# EAGLE design bcard (EAGLE 5.02)
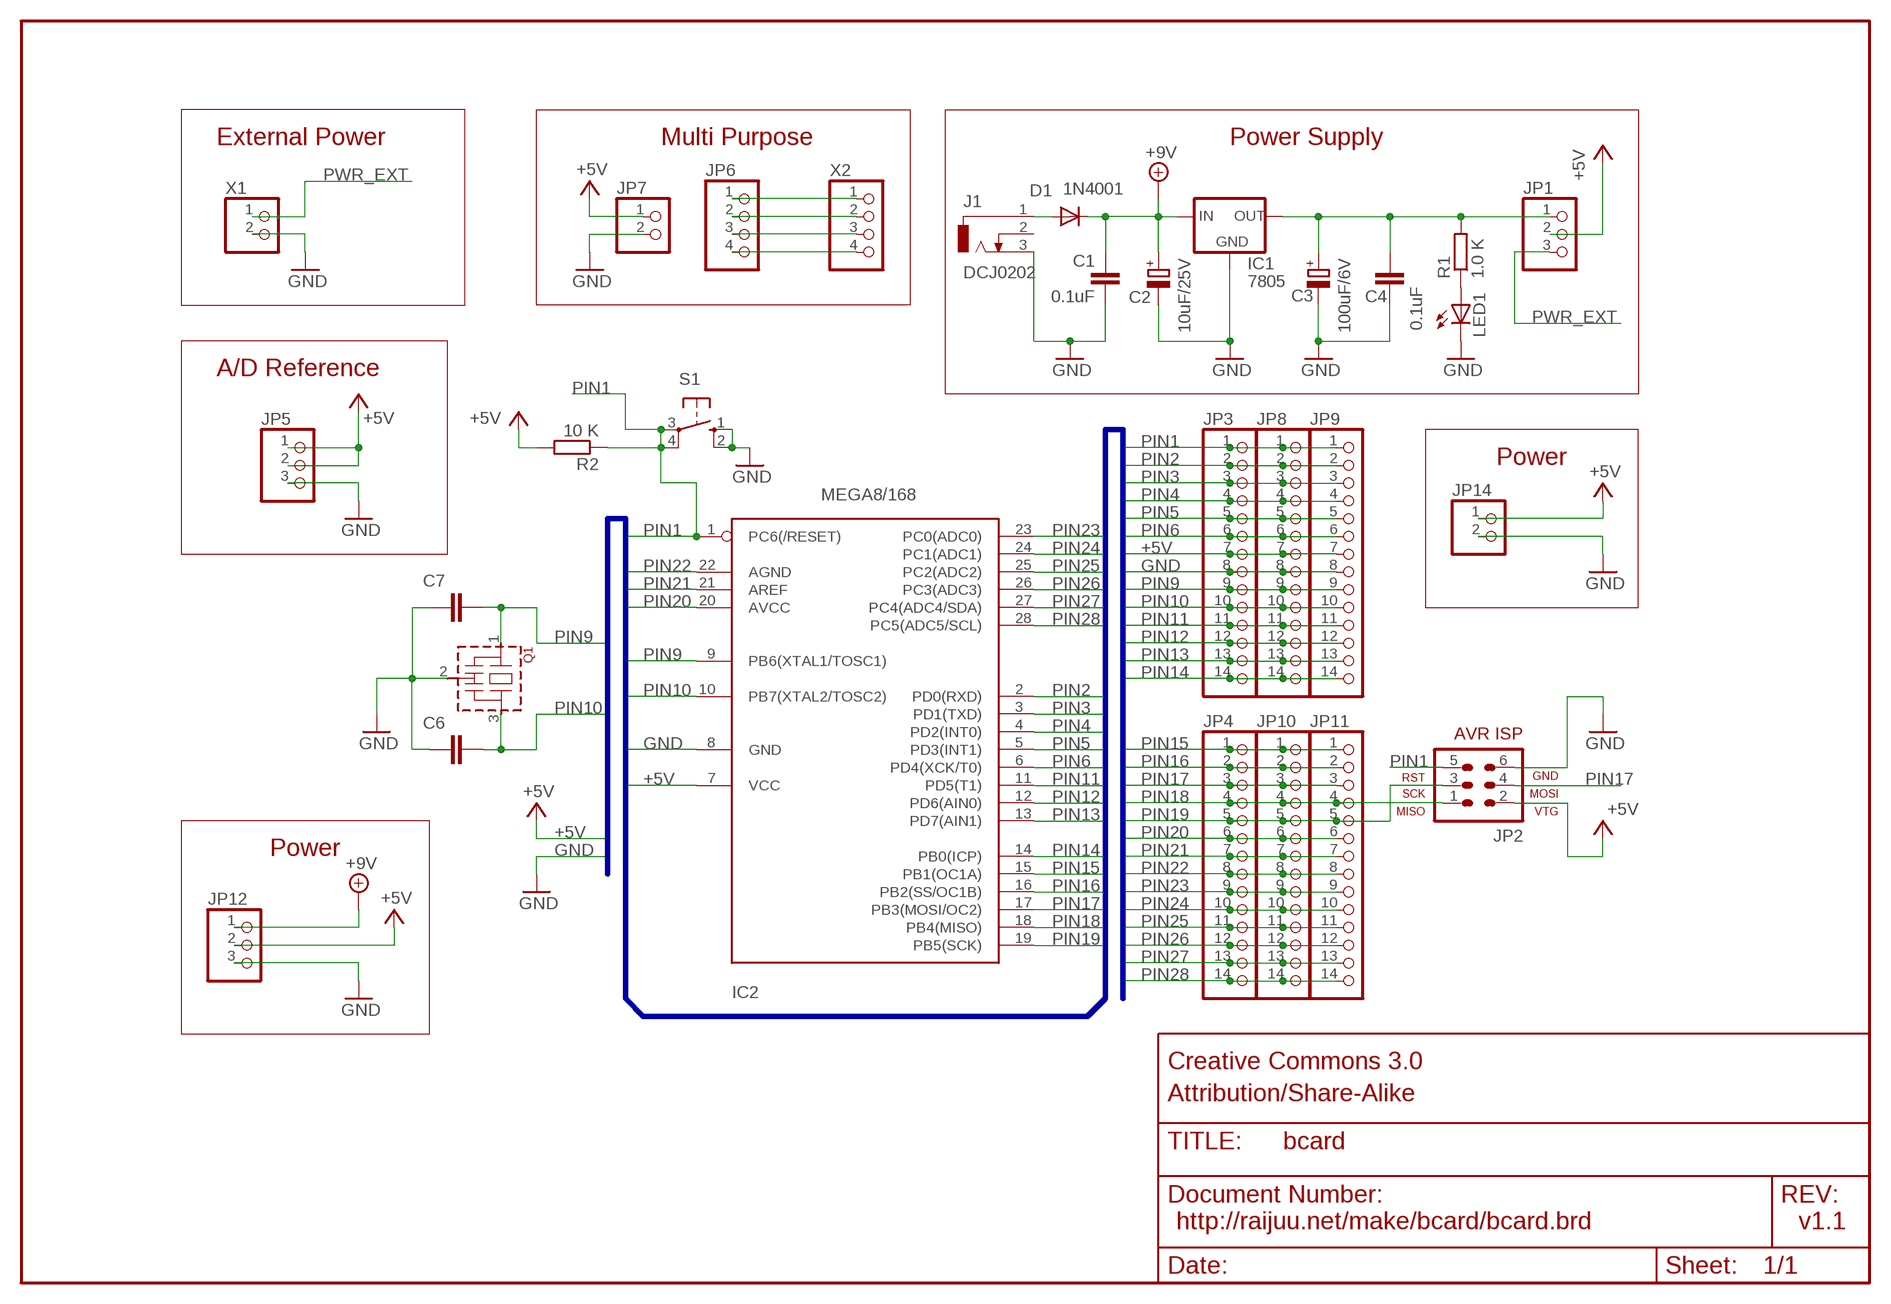
[diagram p0: schematic, sheet 1]

## Parts
C1  0.1uF  C-EU025-025X050  [C025-025X050]
C2  10uF/25V  CPOL-EUE2.5-6  [E2,5-6]
C3  100uF/6V  CPOL-EUE2.5-6  [E2,5-6]
C4  0.1uF  C-EU025-025X050  [C025-025X050]
C6  C-EU025-025X050  [C025-025X050]
C7  C-EU025-025X050  [C025-025X050]
D1  1N4001  1N4004  [DO41-10]
IC1  7805  78XXS  [78XXS]
IC2  MEGA8/168  MEGA8-P  [DIL28-3]
J1  DCJ0202  [DCJ0202A]
JP1  PINHD-1X3  [1X03]
JP2  AVR-ISP-6  AVR-ISP-6-C  [AVR-ISP-6]
JP3  PINHD-1X14  [1X14]
JP4  PINHD-1X14  [1X14]
JP5  PINHD-1X3  [1X03]
JP6  PINHD-1X4  [1X04]
JP7  PINHD-1X2  [1X02]
JP8  PINHD-1X14  [1X14]
JP9  PINHD-1X14  [1X14]
JP10  PINHD-1X14  [1X14]
JP11  PINHD-1X14  [1X14]
JP12  PINHD-1X3  [1X03]
JP14  PINHD-1X2  [1X02]
LED1  LED5MM  [LED5MM]
Q1  CSTLS_G*  [CSTLS_G9]
R1  1.0 K  R-EU_0207/10  [0207/10]
R2  10 K  R-EU_0207/10  [0207/10]
S1  10-XX  [B3F-10XX]
X1  W237-102  [W237-102]
X2  22-23-2041  [22-23-2041]

## Nets
+5V: IC2.7(VCC) JP1.2 JP2.2(VTG) JP3.7 JP5.1 JP5.2 JP7.1 JP8.7 JP9.7 JP12.2 JP14.1 R2.2
+9V: C1.1 C2.+ D1.C IC1.IN JP12.1
GND: C1.2 C2.- C3.- C4.2 C6.1 C7.1 IC1.GND IC2.8(GND) J1.3 JP2.6(GND) JP3.8 JP5.3 JP7.2 JP8.8 JP9.8 JP12.3 JP14.2 LED1.K(C) Q1.2(VSS) S1.1(S) S1.2(S1) X1.2
N$2: LED1.A R1.1
N$3: C3.+ C4.1 IC1.OUT JP1.1 R1.2
N$5: JP6.1 X2.1
N$6: JP6.2 X2.2
N$7: JP6.3 X2.3
N$8: JP6.4 X2.4
N$17: D1.A J1.1
PIN1: IC2.1(PC6(/RESET)) JP2.5(RST) JP3.1 JP8.1 JP9.1 R2.1 S1.3(P) S1.4(P1)
PIN2: IC2.2(PD0(RXD)) JP3.2 JP8.2 JP9.2
PIN3: IC2.3(PD1(TXD)) JP3.3 JP8.3 JP9.3
PIN4: IC2.4(PD2(INT0)) JP3.4 JP8.4 JP9.4
PIN5: IC2.5(PD3(INT1)) JP3.5 JP8.5 JP9.5
PIN6: IC2.6(PD4(XCK/T0)) JP3.6 JP8.6 JP9.6
PIN9: C7.2 IC2.9(PB6(XTAL1/TOSC1)) JP3.9 JP8.9 JP9.9 Q1.1
PIN10: C6.2 IC2.10(PB7(XTAL2/TOSC2)) JP3.10 JP8.10 JP9.10 Q1.3
PIN11: IC2.11(PD5(T1)) JP3.11 JP8.11 JP9.11
PIN12: IC2.12(PD6(AIN0)) JP3.12 JP8.12 JP9.12
PIN13: IC2.13(PD7(AIN1)) JP3.13 JP8.13 JP9.13
PIN14: IC2.14(PB0(ICP)) JP3.14 JP8.14 JP9.14
PIN15: IC2.15(PB1(OC1A)) JP4.1 JP10.1 JP11.1
PIN16: IC2.16(PB2(SS/OC1B)) JP4.2 JP10.2 JP11.2
PIN17: IC2.17(PB3(MOSI/OC2)) JP2.4(MOSI) JP4.3 JP10.3 JP11.3
PIN18: IC2.18(PB4(MISO)) JP2.1(MISO) JP4.4 JP10.4 JP11.4
PIN19: IC2.19(PB5(SCK)) JP2.3(SCK) JP4.5 JP10.5 JP11.5
PIN20: IC2.20(AVCC) JP4.6 JP10.6 JP11.6
PIN21: IC2.21(AREF) JP4.7 JP10.7 JP11.7
PIN22: IC2.22(AGND) JP4.8 JP10.8 JP11.8
PIN23: IC2.23(PC0(ADC0)) JP4.9 JP10.9 JP11.9
PIN24: IC2.24(PC1(ADC1)) JP4.10 JP10.10 JP11.10
PIN25: IC2.25(PC2(ADC2)) JP4.11 JP10.11 JP11.11
PIN26: IC2.26(PC3(ADC3)) JP4.12 JP10.12 JP11.12
PIN27: IC2.27(PC4(ADC4/SDA)) JP4.13 JP10.13 JP11.13
PIN28: IC2.28(PC5(ADC5/SCL)) JP4.14 JP10.14 JP11.14
PWR_EXT: JP1.3 X1.1
Unconnected: J1.2

## Buses
B$1

## Notes on the sheet
- External Power | Multi Purpose | Power Supply
- A/D Reference
- Power
- Power
- Creative Commons 3.0
- Attribution/Share-Alike
- http://raijuu.net/make/bcard/bcard.brd | v1.1

## Library data of the parts
C1 C4 C6 C7 = mega:C-EU: CAPACITOR, European symbol
C2 C3 = mega:CPOL-EU: POLARIZED CAPACITOR, European symbol
D1 = mega:1N4004: DIODE general purpose rectifier, 1 A
IC1 = mega:78XXS: VOLTAGE REGULATOR
IC2 = mega:MEGA8-P: MICROCONTROLLER 8 Kbytes FLASH 1 kbytes SRAM 512 bytes EEPROM USART 4-channel 10 bit ADC 2-channel 8 bit ADC Source: avr.lbr
J1 = mega:DCJ0202: DC POWER JACK Source: DCJ0202.pdf
JP1 JP5 JP12 = mega:PINHD-1X3: PIN HEADER
JP2 = mega:AVR-ISP-6-C: AVR ISP-6 Serial Programming Header
JP3 JP4 JP8-JP11 = mega:PINHD-1X14: PIN HEADER
JP6 = mega:PINHD-1X4: PIN HEADER
JP7 JP14 = mega:PINHD-1X2: PIN HEADER
LED1 = mega:LED: LED OSRAM: - CHIPLED LG R971, LG N971, LY N971, LG Q971, LY Q971, LO R971, LY R971 LH N974, LH R974 LS Q976, LO Q976, LY Q976 LO Q996 - Hyper CHIPLED LW Q18S LB Q993, LB Q99A, LB R99A - SideLED LS A670, LO A670, LY A670, LG A670, LP A670 LB A673, LV A673, LT A673, LW A673 LH A674 LY A675 LS A676, LA A676, LO A676, LY A676, LW A676 LS A679, LY A679, LG A679 - Hyper Micro SIDELED® LS Y876, LA Y876, LO Y876, LY Y876 LT Y87S - SmartLED LW L88C, LW L88S LB L89C, LB L89S, LG L890 LS L89K, LO L89K, LY L89K LS L896, LA L896, LO L896, LY L896 - TOPLED LS T670, LO T670, LY T670, LG T670, LP T670 LSG T670, LSP T670, LSY T670, LOP T670, LYG T670 LG T671, LOG T671, LSG T671 LB T673, LV T673, LT T673, LW T673 LH T674 LS T676, LA T676, LO T676, LY T676, LB T676, LH T676, LSB T676, LW T676 LB T67C, LV T67C, LT T67C, LS T67K, LO T67K, LY T67K, LW E67C LS E67B, LA E67B, LO E67B, LY E67B, LB E67C, LV E67C, LT E67C LW T67C LS T679, LY T679, LG T679 LS T770, LO T770, LY T770, LG T770, LP T770 LB T773, LV T773, LT T773, LW T773 LH T774 LS E675, LA E675, LY E675, LS T675 LS T776, LA T776, LO T776, LY T776, LB T776 LHGB T686 LT T68C, LB T68C - Hyper Mini TOPLED® LB M676 - Mini TOPLED Santana® LG M470 LS M47K, LO M47K, LY M47K Source: http://www.osram.convergy.de - LUMILED® LXK2-PW12-R00, LXK2-PW12-S00, LXK2-PW14-U00, LXK2-PW14-V00 LXK2-PM12-R00, LXK2-PM12-S00, LXK2-PM14-U00 LXK2-PE12-Q00, LXK2-PE12-R00, LXK2-PE12-S00, LXK2-PE14-T00, LXK2-PE14-U00 LXK2-PB12-K00, LXK2-PB12-L00, LXK2-PB12-M00, LXK2-PB14-N00, LXK2-PB14-P00, LXK2-PB14-Q00 LXK2-PR12-L00, LXK2-PR12-M00, LXK2-PR14-Q00, LXK2-PR14-R00 LXK2-PD12-Q00, LXK2-PD12-R00, LXK2-PD12-S00 LXK2-PH12-R00, LXK2-PH12-S00 LXK2-PL12-P00, LXK2-PL12-Q00, LXK2-PL12-R00 Source: www.luxeon.com
Q1 = mega:CSTLS_G: Ceramic resonator 2.00 to 10.00 MHz
R1 R2 = mega:R-EU_: RESISTOR, European symbol
S1 = mega:10-XX: OMRON SWITCH
X1 = mega:W237-102: WAGO SCREW CLAMP
X2 = mega:22-23-2041: .100" (2.54mm) Center Header - 4 Pin

## Board
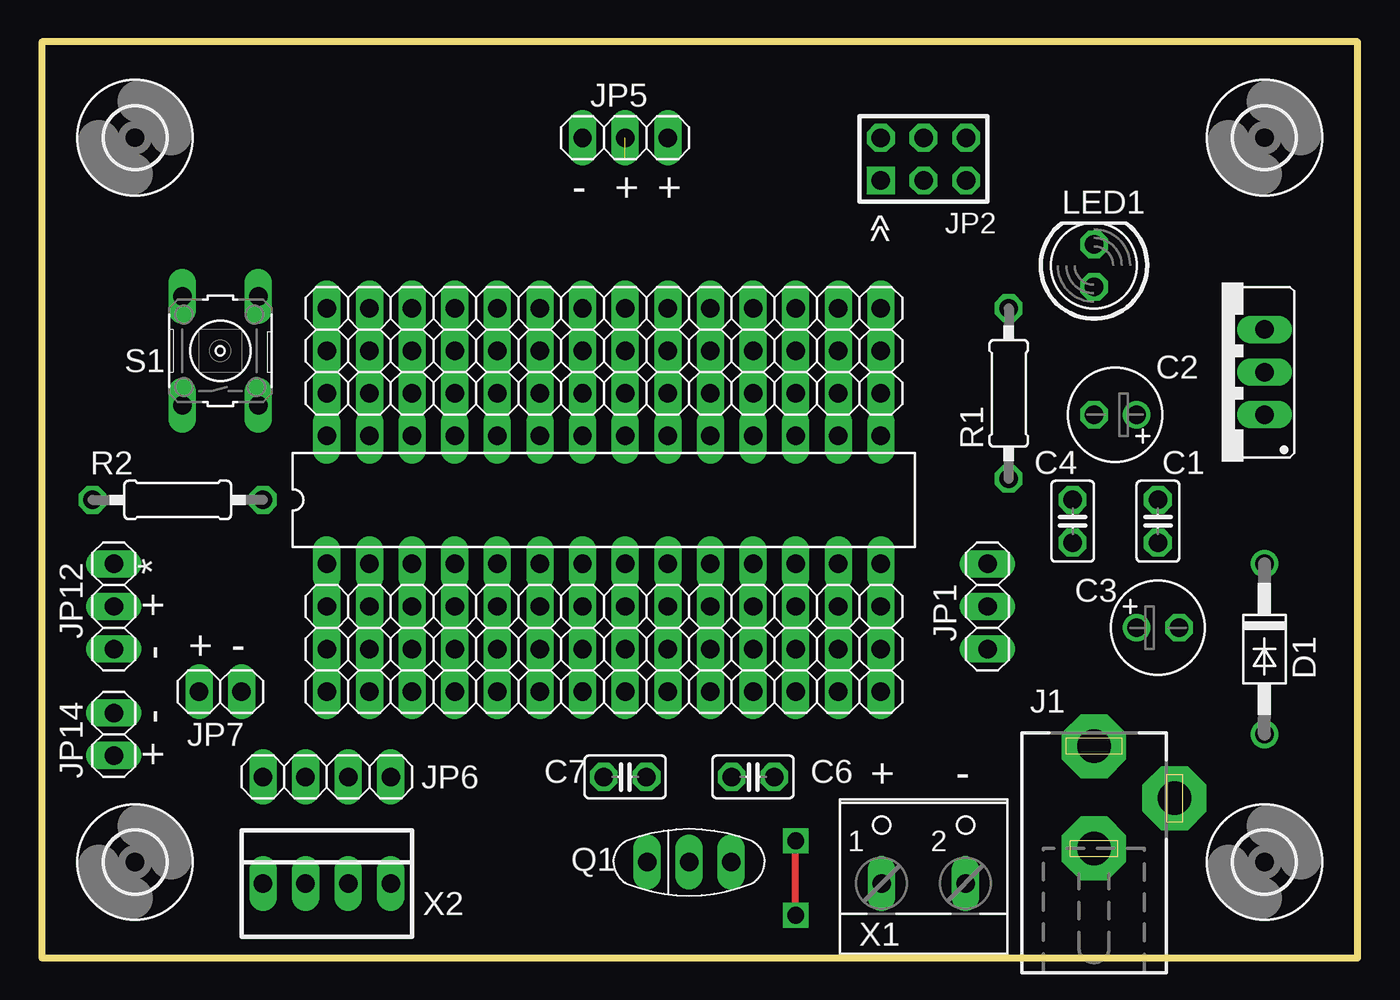
[diagram p1: board, top side]
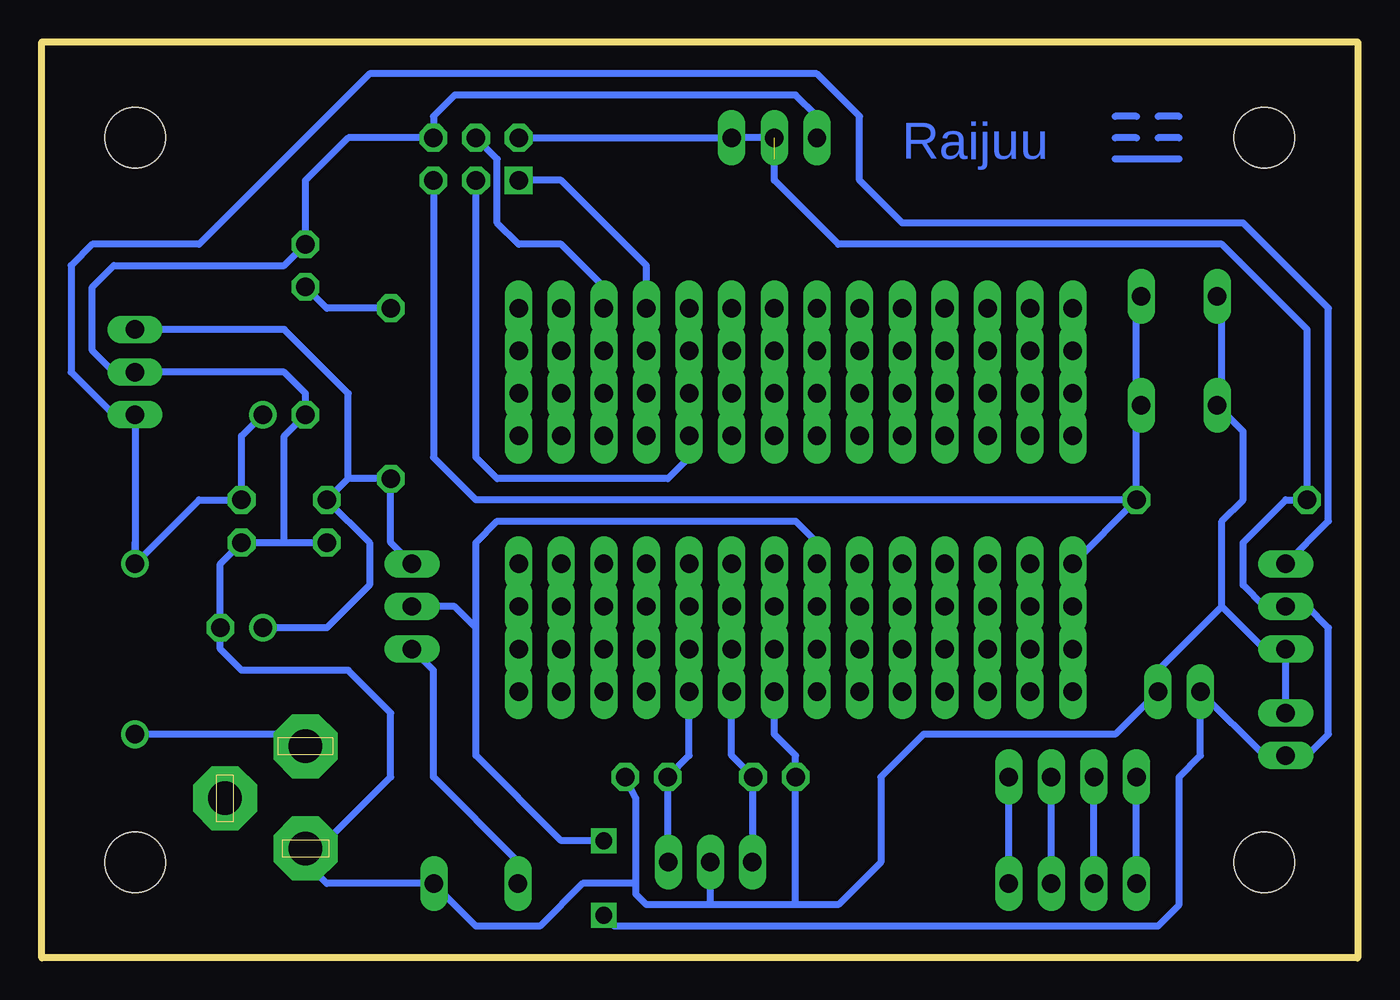
[diagram p2: board, bottom side, seen from below]

Size 78.41 x 54.6 mm. Coordinates in mm from the lower left corner, seen from the top.
Outline: 0,0 78.41,0 78.41,54.6 0,54.6 0,0
Copper layers (1*16): Top 0.035mm / dielectric 1.5mm / Bottom 0.035mm
Design rules "default": minimum track width 10mil, minimum drill 24mil, track to track 8mil, track to pad 8mil, pad to pad 8mil, via to via 8mil, smd to smd 8mil, copper to edge 40mil, drill to drill 8mil, minimum pad ring 10mil, minimum via ring 8mil, stop-mask expansion 4mil, vias tented up to drill 0mil, thermal gap 10mil

### Footprints (pad centres in the part's own frame; a part is rotated, then mirrored left to right if it is on the bottom)
C025-025X050 = drill 1.1 octagon: 1 -1.27,0; 2 1.27,0
E2,5-6 = drill 1.1 round: + -1.27,0 | drill 1.1 pad 1.6 octagon: - 1.27,0
DO41-10 = drill 1.1 round: A 5.08,0; C -5.08,0
78XXS = drill 1.1 long: GND 0,-2.54; IN -2.54,-2.54; OUT 2.54,-2.54
DIL28-3 = drill 1.1 long: 1 -16.51,-3.81; 2 -13.97,-3.81; 3 -11.43,-3.81; 4 -8.89,-3.81; 5 -6.35,-3.81; 6 -3.81,-3.81; 7 -1.27,-3.81; 8 1.27,-3.81; 9 3.81,-3.81; 10 6.35,-3.81; 11 8.89,-3.81; 12 11.43,-3.81; 13 13.97,-3.81; 14 16.51,-3.81; 15 16.51,3.81; 16 13.97,3.81; 17 11.43,3.81; 18 8.89,3.81; 19 6.35,3.81; 20 3.81,3.81; 21 1.27,3.81; 22 -1.27,3.81; 23 -3.81,3.81; 24 -6.35,3.81; 25 -8.89,3.81; 26 -11.43,3.81; 27 -13.97,3.81; 28 -16.51,3.81
DCJ0202A = drill 2 pad 3.81 octagon: 1 0,3.1; 2 4.8,0; 3 0,-3
1X03 = drill 1.1 long: 1 -2.54,0; 2 0,0; 3 2.54,0
AVR-ISP-6 = drill 1.1 square: 1 -2.54,-1.27 | drill 1.1 octagon: 2 -2.54,1.27; 3 0,-1.27; 4 0,1.27; 5 2.54,-1.27; 6 2.54,1.27
1X14 = drill 1.1 long: 1 -16.51,0; 2 -13.97,0; 3 -11.43,0; 4 -8.89,0; 5 -6.35,0; 6 -3.81,0; 7 -1.27,0; 8 1.27,0; 9 3.81,0; 10 6.35,0; 11 8.89,0; 12 11.43,0; 13 13.97,0; 14 16.51,0
1X04 = drill 1.1 long: 1 -3.81,0; 2 -1.27,0; 3 1.27,0; 4 3.81,0
1X02 = drill 1.1 long: 1 -1.27,0; 2 1.27,0
LED5MM = drill 1.1 octagon: A -1.27,0; K 1.27,0
CSTLS_G9 = drill 1.1 long: 1 -2.5,0; 2 0,0; 3 2.5,0
0207/10 = drill 1.1 octagon: 1 -5.08,0; 2 5.08,0
B3F-10XX = drill 1.1 long: 1 -3.251,2.261; 2 3.251,2.261; 3 -3.251,-2.261; 4 3.251,-2.261
3,6 = hole 3.6: 0,0
W237-102 = drill 1.1 long: 1 -2.5,-1.27; 2 2.5,-1.27
22-23-2041 = drill 1.1 long: 1 -3.81,0; 2 -1.27,0; 3 1.27,0; 4 3.81,0

### Placement (x,y rotation side)
C1  66.51,26.03 270 top
C2  63.97,32.38 180 top
C3  66.51,19.68 0 top
C4  61.43,26.03 270 top
C6  42.38,10.79 180 top
C7  34.76,10.79 0 top
D1  72.86,18.41 270 top
IC1  70.32,34.92 90 top
IC2  33.49,27.3 0 top
J1  62.7,9.52 0 top
JP1  56.35,20.95 270 top
JP2  52.54,47.62 0 top
JP3  33.49,15.87 0 top
JP4  33.49,33.65 180 top
JP5  34.76,48.89 180 top
JP6  16.98,10.79 0 top
JP7  10.63,15.87 0 top
JP8  33.49,18.41 0 top
JP9  33.49,20.95 0 top
JP10  33.49,38.73 180 top
JP11  33.49,36.19 180 top
JP12  4.28,20.95 270 top
JP14  4.28,13.33 90 top
LED1  62.7,41.27 90 top
Q1  38.57,5.71 0 top
R1  57.62,33.65 270 top
R2  8.09,27.3 180 top
S1  10.63,36.19 90 top
U$1  [3,6]  5.55,48.89 0 top
U$2  [3,6]  72.86,48.89 0 top
U$3  [3,6]  72.86,5.71 0 top
U$4  [3,6]  5.55,5.71 0 top
X1  52.54,5.71 0 top
X2  16.98,4.44 0 top

### Tracks (layer width: path | path; a pad name or v marks a point on that pad's centre or on a via)
+5V  (via drill 1)  (1 unrouted)
  Top 0.406: v44.92,2.54 v44.92,6.98
  Bottom 0.406: 3.01,20.95 JP12.2 | 3.01,20.95 1.74,19.68 1.74,13.33 3.01,12.06 JP14.1 5.55,12.06 JP7.1 9.36,12.06 10.63,10.79 10.63,3.17 11.9,1.9 44.29,1.9 v44.92,2.54 | 3.01,20.95 5.55,20.95 6.82,22.22 6.82,24.76 4.28,27.3 R2.2 3.01,37.46 8.09,42.54 30.95,42.54 34.76,46.35 34.76,47.62 | JP1.2 53.81,20.95 52.54,19.68 | 52.54,19.68 52.54,12.06 47.46,6.98 v44.92,6.98 | 52.54,19.68 52.54,24.76 51.27,26.03 33.49,26.03 32.22,24.76 IC2.7 JP9.7 JP8.7 JP3.7 | JP5.2 JP5.1 JP2.2
+9V
  Bottom 0.406: D1.C IC1.IN 74.13,32.38 76.67,34.92 76.67,41.27 75.4,42.54 69.05,42.54 58.89,52.7 32.22,52.7 29.68,50.16 29.68,46.35 27.14,43.81 6.82,43.81 1.74,38.73 1.74,26.03 JP12.1 | D1.C 72.86,24.76 | D1.C 69.05,27.3 C1.1 66.51,31.11 C2.+
GND
  Bottom 0.406: S1.2 8.09,39.16 8.09,33.22 S1.1 6.82,31.39 6.82,27.3 8.09,26.03 8.09,20.95 | 8.09,20.95 5.55,18.41 JP12.3 JP14.2 | 8.09,20.95 11.9,17.14 JP7.2 14.44,13.33 25.87,13.33 28.41,10.79 28.41,5.71 30.95,3.17 33.49,3.17 | 62.7,6.98 61.43,6.98 57.62,10.79 57.62,14.6 60.16,17.14 66.51,17.14 67.78,18.41 C3.- 67.78,23.49 C1.2 63.97,24.76 | 62.7,6.98 J1.3 | 62.7,6.98 62.7,5.71 61.43,4.44 X1.2 55.04,4.4 52.54,1.9 48.73,1.9 46.19,4.44 43.02,4.44 | 63.97,24.76 C4.2 | 63.97,24.76 63.97,31.11 C2.- 62.7,33.65 63.97,34.92 IC1.GND 74.13,34.92 75.4,36.19 75.4,40 74.13,41.27 63.97,41.27 LED1.K 62.7,46.35 60.16,48.89 JP2.6 55.08,50.16 53.81,51.43 33.49,51.43 32.22,50.16 JP5.3 | IC2.8 JP9.8 JP8.8 JP3.8 34.76,13.33 33.49,12.06 C7.1 33.49,3.17 | C6.1 43.02,9.52 43.02,4.44 | 33.49,3.17 38.57,3.17 | 38.57,3.17 Q1.2 | 38.57,3.17 42.38,3.17 43.02,3.81 43.02,4.44
N$1
  Bottom 0.406: 10.63,47.62 14.44,47.62
N$2
  Bottom 0.406: R1.1 61.43,38.73 LED1.A
N$3
  Bottom 0.406: JP1.1 57.62,24.76 R1.2 60.16,28.57 | 60.16,28.57 C4.1 58.89,24.76 58.89,22.22 61.43,19.68 C3.+ | IC1.OUT 63.97,37.46 60.16,33.65 60.16,28.57
N$5
  Bottom 0.406: X2.1 JP6.1
N$6
  Bottom 0.406: X2.2 JP6.2
N$7
  Bottom 0.406: X2.3 JP6.3
N$8
  Bottom 0.406: X2.4 JP6.4
N$9
  Bottom 0.406: 13.17,48.89 14.44,48.89
N$10
  Bottom 0.406: 13.17,50.16 14.44,50.16
N$11
  Bottom 0.406: 10.63,48.89 11.9,48.89
N$12
  Bottom 0.406: 10.63,50.16 11.9,50.16
N$17
  Bottom 0.406: D1.A 62.7,13.33 J1.1 62.7,12.06
PIN1
  Bottom 0.406: JP3.1 JP8.1 JP9.1 IC2.1 R2.1 | 13.17,33.22 13.17,33.65 | 13.17,33.22 S1.3 13.17,32.94 R2.1 | 13.17,33.22 13.17,39.72 | 13.17,39.72 S1.4 | 13.17,39.72 13.17,40 | R2.1 52.54,27.3 55.08,29.84 JP2.5
PIN2
  Bottom 0.406: JP3.2 JP8.2 JP9.2 IC2.2
PIN3
  Bottom 0.406: JP3.3 JP8.3 JP9.3 IC2.3
PIN4
  Bottom 0.406: JP3.4 JP8.4 JP9.4 IC2.4
PIN5
  Bottom 0.406: JP3.5 JP8.5 JP9.5 IC2.5
PIN6
  Bottom 0.406: JP3.6 JP8.6 JP9.6 IC2.6
PIN9
  Bottom 0.406: IC2.9 JP9.9 JP8.9 JP3.9 37.3,12.06 C7.2 36.03,5.71 Q1.1
PIN10
  Bottom 0.406: IC2.10 JP9.10 JP8.10 JP3.10 39.84,12.06 C6.2 41.11,5.75 Q1.3
PIN11
  Bottom 0.406: IC2.11 JP9.11 JP8.11 JP3.11
PIN12
  Bottom 0.406: IC2.12 JP9.12 JP8.12 JP3.12
PIN13
  Bottom 0.406: JP3.13 JP8.13 JP9.13 IC2.13
PIN14
  Bottom 0.406: JP3.14 JP8.14 | JP8.14 JP9.14 | JP9.14 IC2.14 | JP8.14 JP9.14
PIN15
  Bottom 0.406: IC2.15 JP4.1 JP11.1 JP10.1
PIN16
  Bottom 0.406: IC2.16 JP4.2 JP11.2 JP10.2
PIN17
  Bottom 0.406: IC2.17 JP4.3 JP11.3 JP10.3 44.92,40 47.46,42.54 50,42.54 51.27,43.81 51.27,47.62 JP2.4
PIN18
  Bottom 0.406: IC2.18 JP4.4 JP11.4 JP10.4 42.38,41.27 47.46,46.35 JP2.1
PIN19
  Bottom 0.406: JP10.5 JP11.5 JP4.5 IC2.19 39.84,29.84 41.11,28.57 51.27,28.57 52.54,29.84 JP2.3
PIN20
  Bottom 0.406: IC2.20 JP4.6 JP11.6 JP10.6
PIN21
  Bottom 0.406: IC2.21 JP4.7 JP11.7 JP10.7
PIN22
  Bottom 0.406: IC2.22 JP4.8 JP11.8 JP10.8
PIN23
  Bottom 0.406: IC2.23 JP4.9 JP11.9 JP10.9
PIN24
  Bottom 0.406: IC2.24 JP4.10 JP11.10 JP10.10
PIN25
  Bottom 0.406: IC2.25 JP4.11 JP11.11 JP10.11
PIN26
  Bottom 0.406: IC2.26 JP4.12 JP11.12 JP10.12
PIN27
  Bottom 0.406: IC2.27 JP4.13 JP11.13 JP10.13
PIN28
  Bottom 0.406: IC2.28 JP4.14 JP11.14 JP10.14
PWR_EXT
  Bottom 0.406: JP1.3 55.08,17.14 55.08,10.79 50,5.71 50,4.44 X1.1

### Text on the board
Bottom: Raijuu
tNames: - | + | + | ^ | ^ | * | + | - | + | - | - | + | + | -